# Altium schematic sheet P5a_Filter1A.SchDoc
size A
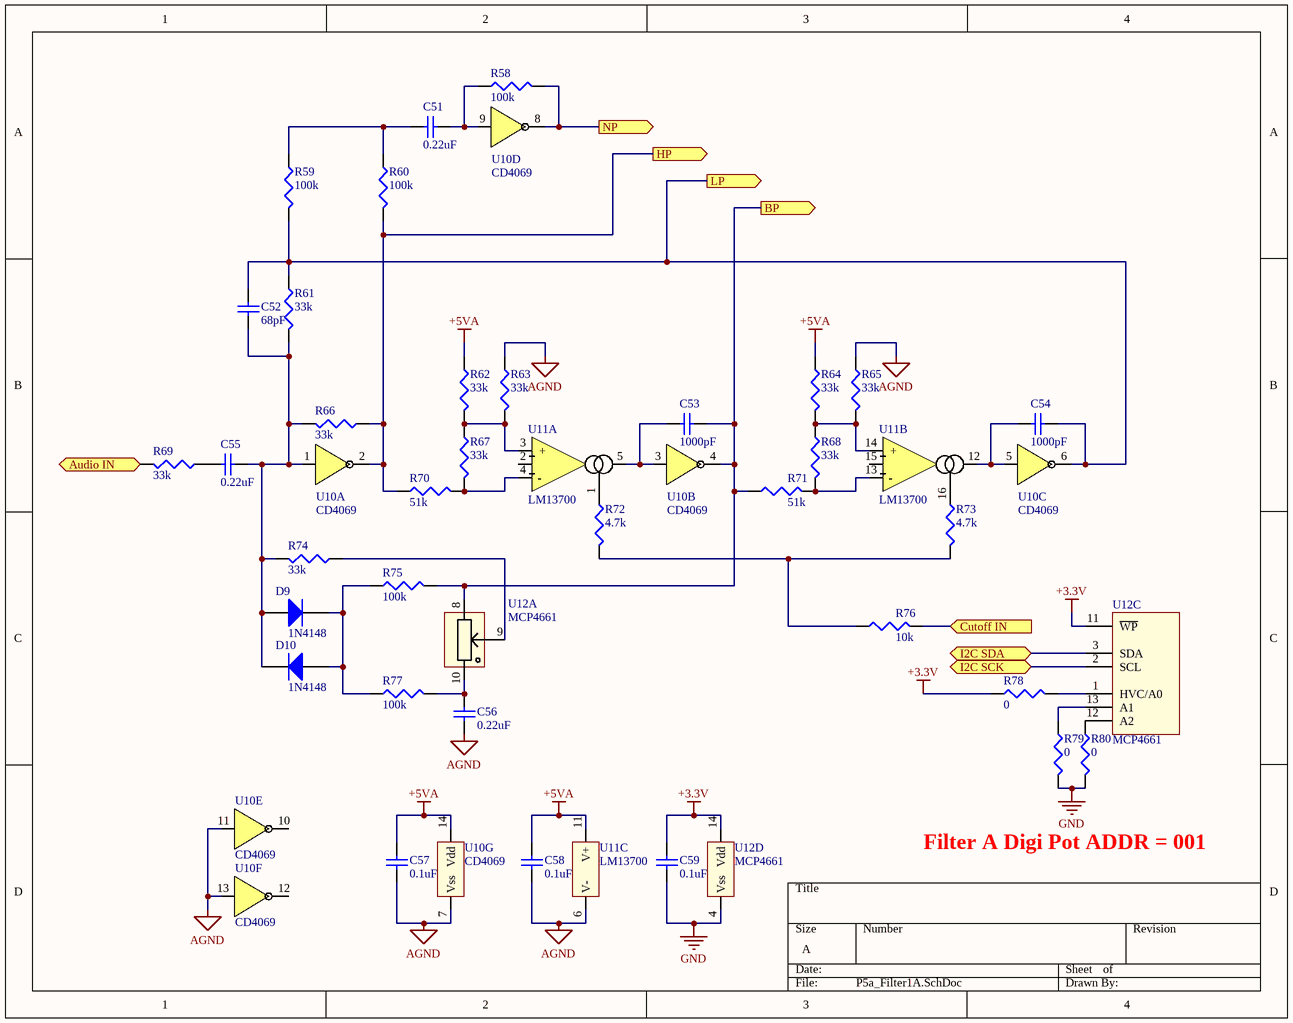
[diagram p0: P5a_Filter1A.SchDoc]

## Parts
C51  0.22uF  [CAP 0603 (1608 metric)]
C52  68pF  [CAP 0603 (1608 metric)]
C53  1000pF  [CAP 0603 (1608 metric)]
C54  1000pF  [CAP 0603 (1608 metric)]
C55  0.22uF  [CAP 0603 (1608 metric)]
C56  0.22uF  [CAP 0603 (1608 metric)]
C57  0.1uF  [CAP 0603 (1608 metric)]
C58  0.1uF  [CAP 0603 (1608 metric)]
C59  0.1uF  [CAP 0603 (1608 metric)]
D9  1N4148
D10  1N4148
R58  100k  [RES 0603 (1608 metric)]
R59  100k  [RES 0603 (1608 metric)]
R60  100k  [RES 0603 (1608 metric)]
R61  33k  [RES 0603 (1608 metric)]
R62  33k  [RES 0603 (1608 metric)]
R63  33k  [RES 0603 (1608 metric)]
R64  33k  [RES 0603 (1608 metric)]
R65  33k  [RES 0603 (1608 metric)]
R66  33k  [RES 0603 (1608 metric)]
R67  33k  [RES 0603 (1608 metric)]
R68  33k  [RES 0603 (1608 metric)]
R69  33k  [RES 0603 (1608 metric)]
R70  51k  [RES 0603 (1608 metric)]
R71  51k  [RES 0603 (1608 metric)]
R72  4.7k  [RES 0603 (1608 metric)]
R73  4.7k  [RES 0603 (1608 metric)]
R74  33k  [RES 0603 (1608 metric)]
R75  100k  [RES 0603 (1608 metric)]
R76  10k  [RES 0603 (1608 metric)]
R77  100k  [RES 0603 (1608 metric)]
R78  0  [RES 0603 (1608 metric)]
R79  0  [RES 0603 (1608 metric)]
R80  0  [RES 0603 (1608 metric)]
U10  CD4069  (parts A,B,C,D,E,F,G of 7)
U11  LM13700  (parts A,B,C of 3)
U12  MCP4661  (parts A,C,D of 4)

## Ports
Audio IN (in), BP (out), Cutoff IN (in), HP (out), I2C SCK, I2C SDA, LP (out), NP (out)

## Nets
+3.3V: C59.1 R78.1 U12.11(~{WP}) U12.14(Vdd)
+5VA: C57.1 C58.1 R62.1 R64.1 U10.14(Vdd) U11.11(V+)
AGND: C56.2 C57.2 C58.2 R63.1 R65.1 U10.7(Vss) U10.11(E) U10.13(F) U11.6(V-)
GND: C59.2 R79.2 R80.2 U12.4(Vss)
Audio IN: R69.2 ; port Audio IN
BP: C53.2 R71.1 R75.2 U10.4(~{B}) U12.8(P0A) ; port BP
Cutoff IN: R76.2 ; port Cutoff IN
HP: R60.2 R66.1 R70.1 U10.2(~{A}) ; port HP
I2C SCK: U12.2(SCL) ; port I2C SCK
I2C SDA: U12.3(SDA) ; port I2C SDA
LP: C52.2 C54.2 R59.2 R61.1 U10.6(~{C}) ; port LP
NP: R58.2 U10.8(~{D}) ; port NP
NetC51_1: C51.1 R59.1 R60.1
NetC51_2: C51.2 R58.1 U10.9(D)
NetC52_1: C52.1 C55.2 D9.1(A) D10.2(K) R61.2 R66.2 R74.2 U10.1(A)
NetC53_1: C53.1 U10.3(B) U11.5(OUT)
NetC54_1: C54.1 U10.5(C) U11.12(OUT)
NetC55_1: C55.1 R69.1
NetC56_1: C56.1 R77.2 U12.10(P0B)
NetD9_2: D9.2(K) D10.1(A) R75.1 R77.1
NetR62_2: R62.2 R63.2 R67.1 U11.3(+)
NetR64_2: R64.2 R65.2 R68.1 U11.14(+)
NetR67_2: R67.2 R70.2 U11.4(-)
NetR68_2: R68.2 R71.2 U11.13(-)
NetR72_1: R72.1 U11.1(BIAS)
NetR72_2: R72.2 R73.2 R76.1
NetR73_1: R73.1 U11.16(BIAS)
NetR74_1: R74.1 U12.9(P0W)
NetR78_2: R78.2 U12.1(HVC/A0)
NetR79_1: R79.1 U12.13(A1)
NetR80_1: R80.1 U12.12(A2)

Not connected (* = marked no-connect by the designer): U10 10(~{E}) 12(~{F}); U11 2(Diode_BIAS) 15(Diode_BIAS)

## Notes on the sheet
- Filter A Digi Pot ADDR = 001

## Library data of the parts
C51-C59 = Cap Semi: Capacitor (Semiconductor SIM Model)
  C51 C55 C56: Value: 0.22uF
  C52: Value: 68pF
  C53 C54: Value: 1000pF
  C57-C59: Value: 0.1uF
D9 D10 = Diode 1N4148: High Conductance Fast Diode
R58-R80 = Res3: Resistor
  R58-R60 R75 R77: Value: 100k
  R61-R69 R74: Value: 33k
  R70 R71: Value: 51k
  R72 R73: Value: 4.7k
  R76: Value: 10k
  R78-R80: Value: 0
U10 = CD4069: Hex Inverter
U11 = LM13700M: Dual Transconductance OpAmp
U12 = MCP4661: Dual DigiPot non volatile I2C